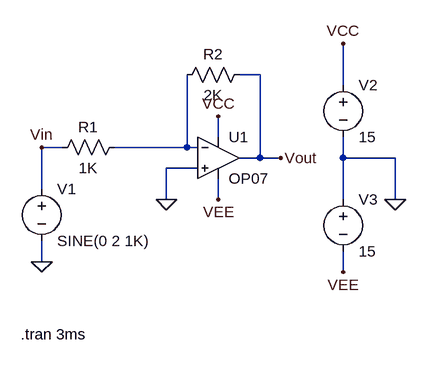
[diagram p0: schematic OP AMP INVERTING.asc]
OP AMP INVERTING.asc, the LTspice schematic file:
Version 4
SHEET 1 880 680
WIRE 256 48 224 48
WIRE 384 64 384 0
WIRE 192 144 192 112
WIRE -48 160 -80 160
WIRE 144 160 144 48
WIRE 144 160 32 160
WIRE 160 160 144 160
WIRE 256 176 256 48
WIRE 256 176 224 176
WIRE 288 176 256 176
WIRE 384 176 384 144
WIRE 464 176 384 176
WIRE 160 192 112 192
WIRE -80 224 -80 160
WIRE 112 240 112 192
WIRE 192 240 192 208
WIRE 384 240 384 176
WIRE 464 240 464 176
WIRE -80 336 -80 304
WIRE 384 352 384 320
FLAG -80 336 0
FLAG 112 240 0
FLAG 464 240 0
FLAG 192 112 VCC
FLAG 384 0 VCC
FLAG 192 240 VEE
FLAG 384 352 VEE
FLAG -80 160 Vin
FLAG 288 176 Vout
SYMBOL OpAmps\\OP07 192 112 R0
SYMATTR InstName U1
SYMBOL res 48 144 R90
WINDOW 0 0 56 VBottom 2
WINDOW 3 32 56 VTop 2
SYMATTR InstName R1
SYMATTR Value 1K
SYMBOL res 240 32 R90
WINDOW 0 0 56 VBottom 2
WINDOW 3 32 56 VTop 2
SYMATTR InstName R2
SYMATTR Value 2K
SYMBOL voltage -80 208 R0
WINDOW 123 0 0 Left 0
WINDOW 39 0 0 Left 0
SYMATTR InstName V1
SYMATTR Value SINE(0 2 1K)
SYMBOL voltage 384 48 R0
WINDOW 123 0 0 Left 0
WINDOW 39 0 0 Left 0
SYMATTR InstName V2
SYMATTR Value 15
SYMBOL voltage 384 224 R0
SYMATTR InstName V3
SYMATTR Value 15
TEXT -112 448 Left 2 !.tran 3ms

The netlist it stands for:
* OP AMP INVERTING.asc
XU1 0 N001 VCC VEE Vout LT1001  ; OP07, pins In+ In- V+ V- OUT
R1 N001 Vin 1K
R2 Vout N001 2K
V1 Vin 0 SINE(0 2 1K)
V2 VCC 0 15
V3 0 VEE 15
.tran 3ms
.lib LTC.lib
.backanno
.end